# Altium schematic sheet MAIN.SchDoc
size 594 x 420 mm; SheetNumber: 1; SheetTotal: 4
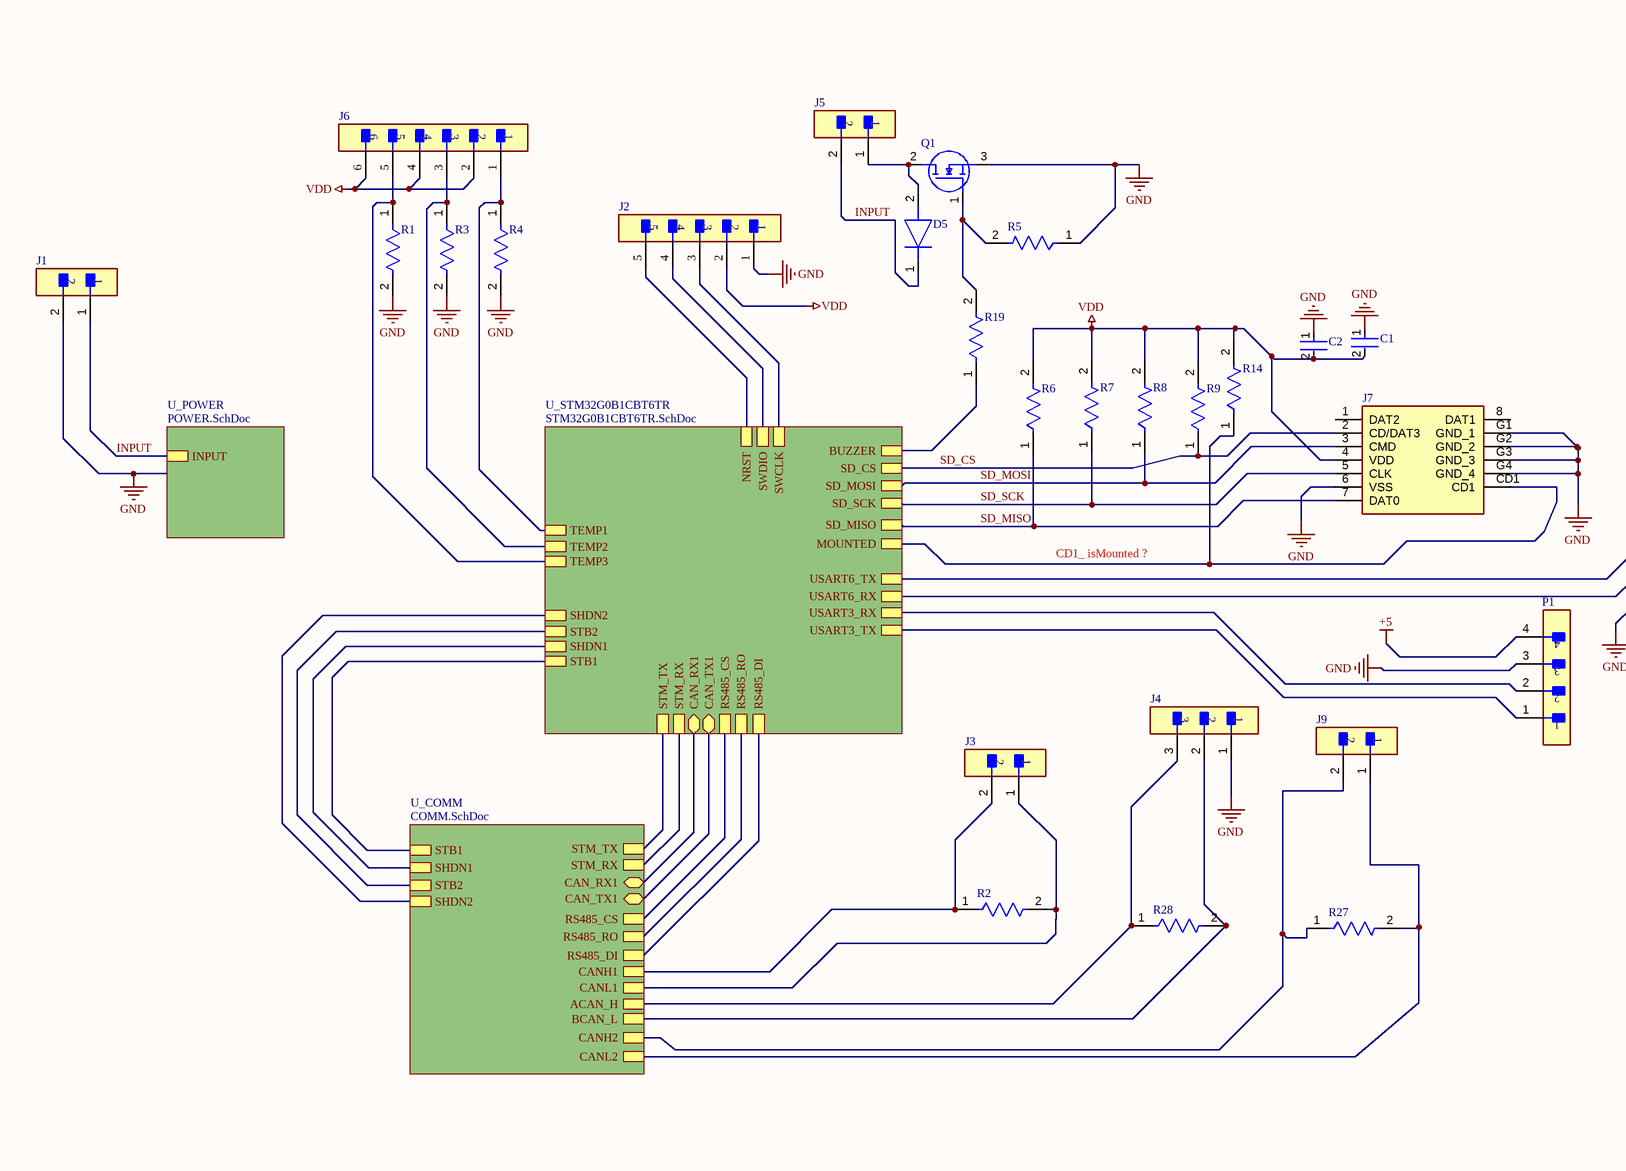
[diagram p0: MAIN.SchDoc, left]
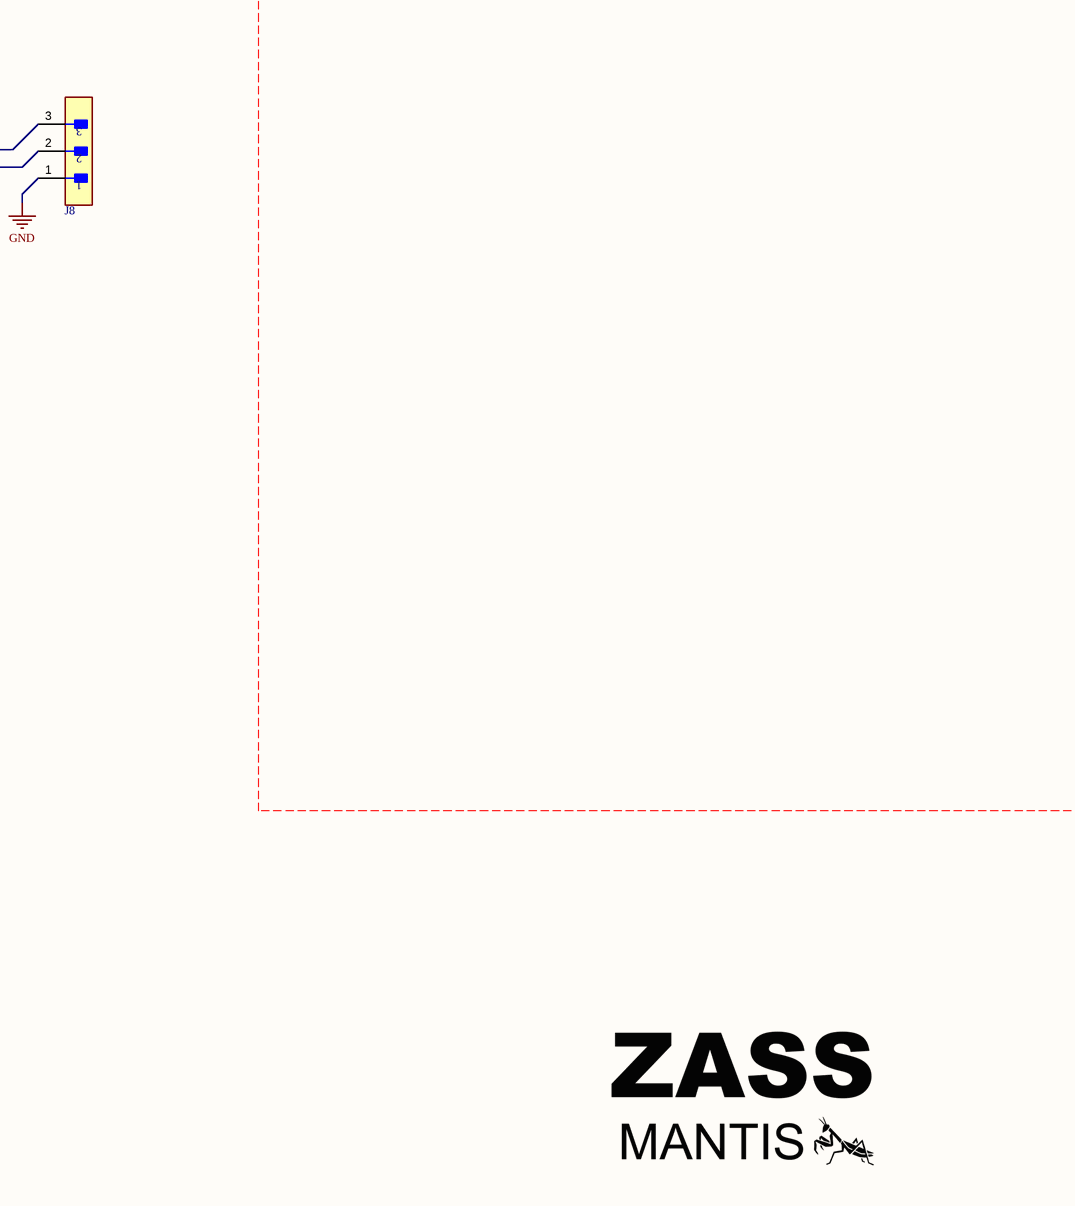
[diagram p1: MAIN.SchDoc, right]

## Parts
C1  CC0805KRX7R5BB104  [FP-CC0805-EA-MFG]  (value not drawn)
C2  CC0805KRX7R5BB104  [FP-CC0805-EA-MFG]  (value not drawn)
D5  1N4007WS  [SOD2613X110N]  (value not drawn)
J1  B2B-XH-A(LF)(SN)  [FP-B2B-XH-A_LF_SN-MFG]  (value not drawn)
J2  B5B-XH-AM(LF)(SN)  [FP-B5B-XH-AM_LF_SN-MFG]  (value not drawn)
J3  B2B-XH-A(LF)(SN)  [FP-B2B-XH-A_LF_SN-MFG]  (value not drawn)
J4  B3B-XH-A(LF)(SN)  [FP-B3B-XH-A_LF_SN-MFG]  (value not drawn)
J5  S2B-XH-A(LF)(SN)  [FP-B2B-XH-A_LF_SN-MFG]  (value not drawn)
J6  B6B-XH-AM(LF)(SN)  [FP-B6B-XH-AM_LF_SN-MFG]  (value not drawn)
J7  MSD-4-A  [MSD4A]  (value not drawn)
J8  B3B-XH-A(LF)(SN)  [FP-B3B-XH-A_LF_SN-MFG]  (value not drawn)
J9  B2B-XH-A(LF)(SN)  [FP-B2B-XH-A_LF_SN-MFG]  (value not drawn)
P1  B4B-XH-A(LF)(SN)  [FP-B4B-XH-A_LF_SN-MFG]  (value not drawn)
Q1  AO3422  [SOT95P237X112-3N]  (value not drawn)
R1  CRGCQ0603J10K  [FP-CRGCQ0603-IPC_C]  (value not drawn)
R2  CRGCQ0603F120R  [FP-CRGCQ0603-IPC_C]  (value not drawn)
R3  CRGCQ0603J10K  [FP-CRGCQ0603-IPC_C]  (value not drawn)
R4  CRGCQ0603J10K  [FP-CRGCQ0603-IPC_C]  (value not drawn)
R5  CRGCQ0603J10K  [FP-CRGCQ0603-IPC_C]  (value not drawn)
R6  CRCW06034K70FKEA  [FP-CRCW0603-e3-IPC_A]  (value not drawn)
R7  CRCW06034K70FKEA  [FP-CRCW0603-e3-IPC_A]  (value not drawn)
R8  CRCW06034K70FKEA  [FP-CRCW0603-e3-IPC_A]  (value not drawn)
R9  CRCW06034K70FKEA  [FP-CRCW0603-e3-IPC_A]  (value not drawn)
R14  CRCW06034K70FKEA  [FP-CRCW0603-e3-IPC_A]  (value not drawn)
R19  CRGCQ0603F1K2  [FP-CRGCQ0603-IPC_C]  (value not drawn)
R27  CRGCQ0603F120R  [FP-CRGCQ0603-IPC_C]  (value not drawn)
R28  CRGCQ0603F120R  [FP-CRGCQ0603-IPC_C]  (value not drawn)

## Sub-sheets
U_COMM = COMM.SchDoc: CAN_TX1 (bidir), CAN_RX1 (bidir), ACAN_H, BCAN_L, STM_RX, STM_TX, RS485_CS, CANH1, CANL1, STB1, SHDN1, STB2, SHDN2, CANL2, CANH2, RS485_DI, RS485_RO
U_POWER = POWER.SchDoc: INPUT
U_STM32G0B1CBT6TR = STM32G0B1CBT6TR.SchDoc: CAN_RX1 (bidir), CAN_TX1 (bidir), STM_TX, STM_RX, USART3_RX, USART3_TX, TEMP1, TEMP2, TEMP3, SD_CS, SD_SCK, SD_MISO, SD_MOSI, BUZZER, RS485_CS, NRST, SWCLK, SWDIO, STB1, SHDN1, STB2, SHDN2, MOUNTED, RS485_DI, RS485_RO, USART6_RX, USART6_TX

## Nets
+5: P1.4
GND: C1.1 C2.1 J1.2 J2.1 J4.1 J7.6(VSS) J7.G1(GND_1) J7.G2(GND_2) J7.G3(GND_3) J7.G4(GND_4) J8.1 P1.3 Q1.3(S) R1.2 R3.2 R4.2 R5.1
VDD: C1.2 C2.2 J2.2 J6.2 J6.4 J6.6 J7.4(VDD) R6.2 R7.2 R8.2 R9.2 R14.2
INPUT: D5.1(K) J1.1 J5.2 ; sheet U_POWER/INPUT
SD_CS: J7.2(CD/DAT3) R9.1 ; sheet U_STM32G0B1CBT6TR/SD_CS
SD_MISO: J7.7(DAT0) R6.1 ; sheet U_STM32G0B1CBT6TR/SD_MISO
SD_MOSI: J7.3(CMD) R8.1 ; sheet U_STM32G0B1CBT6TR/SD_MOSI
SD_SCK: J7.5(CLK) R7.1 ; sheet U_STM32G0B1CBT6TR/SD_SCK
NetD5_2: D5.2(A) J5.1 Q1.2(D)
NetJ2_3: J2.3 ; sheet U_STM32G0B1CBT6TR/SWCLK
NetJ2_4: J2.4 ; sheet U_STM32G0B1CBT6TR/SWDIO
NetJ2_5: J2.5 ; sheet U_STM32G0B1CBT6TR/NRST
NetJ3_1: J3.1 R2.2 ; sheet U_COMM/CANL1
NetJ3_2: J3.2 R2.1 ; sheet U_COMM/CANH1
NetJ4_2: J4.2 R28.2 ; sheet U_COMM/BCAN_L
NetJ4_3: J4.3 R28.1 ; sheet U_COMM/ACAN_H
NetJ6_1: J6.1 R4.1 ; sheet U_STM32G0B1CBT6TR/TEMP1
NetJ6_3: J6.3 R3.1 ; sheet U_STM32G0B1CBT6TR/TEMP2
NetJ6_5: J6.5 R1.1 ; sheet U_STM32G0B1CBT6TR/TEMP3
NetJ7_CD1: J7.CD1 R14.1 ; sheet U_STM32G0B1CBT6TR/MOUNTED
NetJ8_2: J8.2 ; sheet U_STM32G0B1CBT6TR/USART6_RX
NetJ8_3: J8.3 ; sheet U_STM32G0B1CBT6TR/USART6_TX
NetJ9_1: J9.1 R27.2 ; sheet U_COMM/CANL2
NetJ9_2: J9.2 R27.1 ; sheet U_COMM/CANH2
NetP1_1: P1.1 ; sheet U_STM32G0B1CBT6TR/USART3_TX
NetP1_2: P1.2 ; sheet U_STM32G0B1CBT6TR/USART3_RX
NetQ1_1: Q1.1(G) R5.2 R19.2
NetR19_1: R19.1 ; sheet U_STM32G0B1CBT6TR/BUZZER
(unnamed): sheet U_STM32G0B1CBT6TR/CAN_RX1, sheet U_COMM/CAN_RX1
(unnamed): sheet U_STM32G0B1CBT6TR/CAN_TX1, sheet U_COMM/CAN_TX1
(unnamed): sheet U_STM32G0B1CBT6TR/STM_TX, sheet U_COMM/STM_TX
(unnamed): sheet U_STM32G0B1CBT6TR/STM_RX, sheet U_COMM/STM_RX
(unnamed): sheet U_STM32G0B1CBT6TR/RS485_CS, sheet U_COMM/RS485_CS
(unnamed): sheet U_STM32G0B1CBT6TR/STB1, sheet U_COMM/STB1
(unnamed): sheet U_STM32G0B1CBT6TR/SHDN1, sheet U_COMM/SHDN1
(unnamed): sheet U_STM32G0B1CBT6TR/STB2, sheet U_COMM/STB2
(unnamed): sheet U_STM32G0B1CBT6TR/SHDN2, sheet U_COMM/SHDN2
(unnamed): sheet U_STM32G0B1CBT6TR/RS485_DI, sheet U_COMM/RS485_DI
(unnamed): sheet U_STM32G0B1CBT6TR/RS485_RO, sheet U_COMM/RS485_RO

Not connected (* = marked no-connect by the designer): J7 1(DAT2) 8(DAT1)

## Notes on the sheet
- CD1_ isMounted ?
- DWG NO:
- REV:
- THIS DOCUMENT AND THE DATA DISCLOSED HEREIN OR
- HEREWITH IS THE PROPERTY OF ALTIUM LIMITED AND MAY
- BE FREELY DISTRIBUTED IN WHOLE. NO RIGHTS ARE
- RESERVED OR EXPRESS OR IMPLIED WARANTEE GIVEN.
- REVISION
- DESCRIPTION
- DATE
- APPROVED
- PROJECT
- PROJECT REVISION:
- TITLE
- A2
- SIZE
- FILE NAME
- SHEET
- OF

## Library data of the parts
C1 C2 = CMP-03422-000810-2: CAP CER X7R 0805; RoHS Compliant: Yes
D5 = 1N4007WS: Diode; Manufacturer_Name: MDD; Datasheet Link: https://datasheet.lcsc.com/szlcsc/MDD-Jiangsu-Yutai-Elec-1N4007WS_C193404.pdf; Height: 1.1mm; Manufacturer_Part_Number: 1N4007WS
J1 J3 J5 J9 = CMP-2000-05888-3: CONN HEADER VERT 2POS 2.5MM; Current Rating: 3A; Voltage Rating: 250V; Number of Contacts: 2; Contact Resistance: 20mR; Wire/Cable Gauge: 22AWG; Insulation Resistance: 1GR; Connector Type: Male Pin; Packaging: Bulk; Contact Material: Brass; Lead Free: Lead Free; Orientation: Straight; Contact Plating: Tin; Max Current Rating: 3A; Termination: Solder; Fastening Type: Detent; Depth: 5.75mm; Housing Material: Polyamide; REACH SVHC: No SVHC; Series: XH; Voltage Rating (AC): 250V; Number of Positions: 2; Color: Natural; Contact Type: Male Pin; Max Voltage Rating (DC): 250V; Pitch: 2.5mm; Lead Pitch: 2.5mm; Mount: Through Hole; Max Operating Temperature: 85°C; Length: 7.4mm; Max Voltage Rating (AC): 250V; Min Operating Temperature: -25°C; Number of Rows: 1; Housing Color: White
J2 = CMP-17439-000304-1: CONN HEADER VERT 5POS 2.5MM; Mated Stacking Heights: 9.8mm; Voltage Rating: 250V; Max Current Rating: 3A; Number of Positions: 5; Contact Resistance: 20mR; Depth: 5.75mm; Connector Type: Header; Color: Green; Insulation Material: Nylon; Contact Plating: Copper; Length: 14.9mm; Fastening Type: Detent; Contact Material: Brass; Number of Rows: 1; Contact Type: Male Pin; Housing Material: Polyamide; Housing Color: White; Lead Free: Lead Free; Max Voltage Rating (AC): 250V; Mount: Through Hole; Contact Shape: Square; Min Operating Temperature: -25°C; Packaging: Bulk; Orientation: Straight; Insulation Color: Natural; Series: XH; Flammability Rating: UL94 V-0; Contact Finish - Mating: TIN; Max Operating Temperature: 85°C; Termination: Solder; Pitch: 2.5mm
J4 J8 = CMP-17439-000014-3: CONN HEADER VERT 3POS 2.5MM; Max Voltage Rating (DC): 250V; Number of Positions: 3; Current Rating: 3A; Gender: Male; Wire/Cable Gauge: 22AWG; Contact Resistance: 20mR; Insulation Resistance: 1GR; Insulation Material: Nylon; Contact Plating: Tin; Depth: 5.75mm; Contact Type: Male Pin; Max Operating Temperature: 85°C; Insulation Color: Natural; Voltage Rating (AC): 250V; Color: Natural; Connector Type: Header; Orientation: Straight; Fastening Type: Detent; Housing Color: White; Min Operating Temperature: -25°C; Termination: Solder; Voltage Rating: 250V; Series: XH; Pitch: 2.5mm; Contact Shape: Square; Number of Rows: 1; Lead Free: Lead Free; Packaging: Bulk; Mount: Through Hole; Flammability Rating: UL94 V-0; Max Voltage Rating (AC): 250V; REACH SVHC: No SVHC; Housing Material: Polyamide; Contact Material: Brass; Lead Pitch: 2.5mm; Contact Finish - Mating: TIN; Length: 9.9mm; Max Current Rating: 3A; Number of Contacts: 3
J6 = CMP-17439-000167-1: CONN HEADER VERT 6POS 2.5MM; Shape: Straight; Current Rating: 3A; Mated Stacking Heights: 9.8mm; Number of Positions: 6; Voltage Rating: 250V; Pitch: 2.5mm; Insulation Color: Natural; Number of Pins: 6; Width: 5.75mm; Flammability Rating: UL94 V-0; Packaging: Bulk; Connector Type: Header; Number of Rows: 1; Contact Plating: Copper; Mount: Through Hole; Min Operating Temperature: -25°C; Contact Type: Male Pin; Contact Shape: Square; Fastening Type: Detent; Length: 17.4mm; Series: XH; Contact Finish - Mating: TIN; Max Operating Temperature: 85°C; Insulation Material: Nylon; Number of Poles: 6; Termination: Press-Fit; Contact Material: Brass; Height: 7mm
J7 = MSD-4-A: Connector; Manufacturer_Name: Same Sky; Datasheet Link: https://www.sameskydevices.com/product/resource/MSD-4-A.pdf; Height: 2mm; Manufacturer_Part_Number: MSD-4-A; Mouser Part Number: 179-MSD-4-A; Mouser Price/Stock: https://www.mouser.co.uk/ProductDetail/Same-Sky/MSD-4-A?qs=Z%252BL2brAPG1Jll%252BQTi%252Btupg%3D%3D; Arrow Part Number: MSD-4-A; Arrow Price/Stock: https://www.arrow.com/en/products/msd-4-a/cui-devices?utm_currency=USD&region=nac
P1 = CMP-17439-000250-1: CONN HEADER VERT 4POS 2.5MM; Number of Contacts: 4; Contact Resistance: 20mR; Voltage Rating: 250V; Max Current Rating: 3A; Gender: Male; Wire/Cable Gauge: 22AWG; Mated Stacking Heights: 9.8mm; Insulation Resistance: 1GR; Orientation: Straight; Contact Type: Male Pin; Contact Finish - Mating: TIN; Series: XH; Max Voltage Rating (AC): 250V; Lead Pitch: 2.5mm; Contact Shape: Square; Insulation Color: Natural; Termination: Solder; Lead Free: Lead Free; Voltage Rating (AC): 250V; Number of Rows: 1; Flammability Rating: UL94 V-0; Number of Positions: 4; Max Operating Temperature: 85°C; Package Quantity: 500; Mount: Through Hole; REACH SVHC: No SVHC; Connector Type: Header; Insulation Material: Nylon; Fastening Type: Detent; Min Operating Temperature: -25°C; Housing Color: White; Packaging: Bulk; Contact Plating: Tin; Contact Material: Brass; Max Voltage Rating (DC): 250V; Housing Material: Polyamide; Color: Natural; Material: Polyamide; Pitch: 2.5mm; Depth: 5.75mm; Current Rating: 3A; Length: 12.4mm
Q1 = AO3422: MOSFET (N-Channel); Manufacturer_Name: Alpha & Omega Semiconductors; Datasheet Link: http://aosmd.com/res/data_sheets/AO3422.pdf; Height: 1.12mm; Manufacturer_Part_Number: AO3422; Arrow Part Number: AO3422; Arrow Price/Stock: https://www.arrow.com/en/products/ao3422/alpha-and-omega-semiconductor?region=nac
R1 R3-R5 = CMP-03211-009884-1: CRGCQ 0603 10K 5%; Manufacturer: TE Connectivity; Tolerance: 0.05; Power Rating: 0.1W; Resistance: 10KΩ; Voltage Rating: 75V; Value: 10KΩ; Temperature Coefficient: ±100ppm/°C; Composition: Thick Film; ComponentLink2URL: https://www.te.com/commerce/DocumentDelivery/DDEController?Action=showdoc&DocId=Data+Sheet%7F1773204-3%7F1%7Fpdf%7FEnglish%7FENG_DS_1773204-3_1.pdf%7F4-2176339-923; Device Class L1: Passive Components; Package: CRGCQ0603; Mouser Description: Res Thick Film 0603 10K Ohm 5% 0.1W(1/10W) ±100ppm/C Pad SMD Automotive T/R; Temperature Range High: +155°C; Category: Res; Device Class L2: Resistors; Height: 0.55mm; RoHS: TRUE; Lead Free: Yes; Ipc Land Pattern Name: RESC16080X45; Temperature: -55°C to +155°C; Series: CRGCQ; Digikey Description: CRGCQ 0603 10K 5%; Octopart: https://octopart.com/crgcq0603j10k-te+connectivity-91018097; Device Class L3: Chip SMD Resistors; Ambient Temperature Range High: +70°C; ComponentLink2Description: Datasheet; Temperature Range Low: -55°C; Manufacturer Part Number: CRGCQ0603J10K
R2 R27 R28 = CMP-03211-001601-1: CRGCQ0603 120Ω 1% ±100ppm/°C 75V; Manufacturer: TE Connectivity; Tolerance: 0.01; Power Rating: 0.1W; Voltage Rating: 75V; Device Class L2: Resistors; Ambient Temperature Range High: +70°C; Mouser Description: Res, Aec-Q200, Thick Film, 120R, 1%, 0603; Composition: Thick Film; Device Class L1: Passive Components; Temperature Range Low: -55°C; Manufacturer Part Number: CRGCQ0603F120R; Lead Free: Yes; Value: 120Ω; ComponentLink2Description: Datasheet; Device Class L3: Chip SMD Resistors; Package: CRGCQ0603; Ipc Land Pattern Name: RESC16080X45; Height: 0.55mm; Category: Res; RoHS: TRUE; Temperature Range High: +155°C; Resistance: 120Ω; Octopart: https://octopart.com/crgcq0603f120r-te+connectivity-91018039; Temperature Coefficient: ±100ppm/°C; ComponentLink2URL: https://www.te.com/commerce/DocumentDelivery/DDEController?Action=showdoc&DocId=Data+Sheet%7F1773204-3%7F1%7Fpdf%7FEnglish%7FENG_DS_1773204-3_1.pdf%7F4-2176339-482; Temperature: -55°C to +155°C; Series: CRGCQ
R6-R9 R14 = CMP-1666-00019-3: RES Thick Film, 4.7kΩ, 1%, 0.1W, 100ppm/°C, 0603; Resistance: 4.7kR; Voltage Rating: 75V; Power Rating: 100mW; Case Code (Metric): 1608; Military Standard: Not; Packaging: Tape and Reel; Termination: SMD/SMT; Temperature Coefficient: 100ppm/°C; Lead Free: Lead Free; Length: 1.55mm; Width: 0.85mm; Height: 0.45mm; Depth: 0.85mm; Weight: 7.1E-05oz; Case Code (Imperial): 0603; Contact Plating: Tin; Case/Package: 0603; Max Operating Temperature: 155°C; Mount: Surface Mount; Tolerance: 1%; Min Operating Temperature: -55°C; Package Quantity: 5000; Voltage Rating (DC): 75V; Composition: Thick Film
R19 = CMP-03211-000516-1: CRGCQ 0603 1K2 1%; Manufacturer: TE Connectivity; Power Rating: 0.1W; Resistance: 1.2KΩ; Value: 1.2KΩ; Voltage Rating: 75V; Temperature Coefficient: ±100ppm/°C; Tolerance: 0.01; Octopart: https://octopart.com/crgcq0603f1k2-te+connectivity-91018051; ComponentLink2Description: Datasheet; ComponentLink2URL: https://www.te.com/commerce/DocumentDelivery/DDEController?Action=showdoc&DocId=Data+Sheet%7F1773204-3%7F1%7Fpdf%7FEnglish%7FENG_DS_1773204-3_1.pdf%7F4-2176339-710; Category: Res; Temperature: -55°C to +155°C; Temperature Range High: +155°C; Ipc Land Pattern Name: RESC16080X45; Device Class L2: Resistors; Height: 0.55mm; Ambient Temperature Range High: +70°C; RoHS: TRUE; Package: CRGCQ0603; Temperature Range Low: -55°C; Digikey Description: CRGCQ 0603 1K2 1%; Series: CRGCQ; Lead Free: Yes; Manufacturer Part Number: CRGCQ0603F1K2; Device Class L1: Passive Components; Composition: Thick Film; Device Class L3: Chip SMD Resistors